# Altium project 100870_project.prjpcb
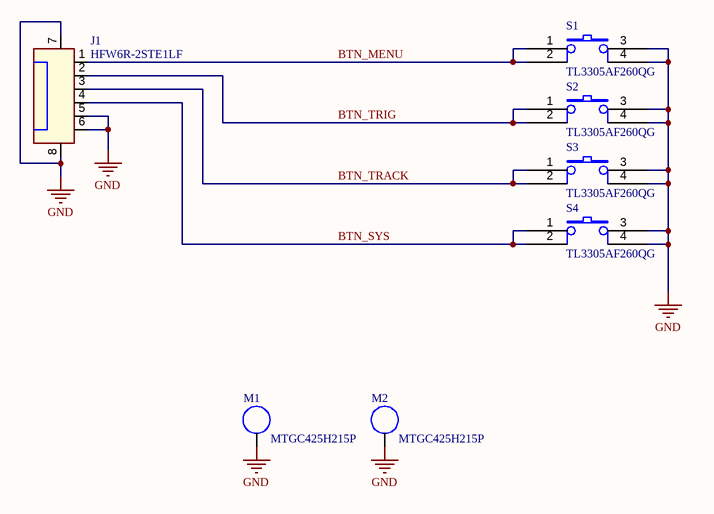
[diagram p0: Handle_Button.SchDoc]
Board_Name: Handle Button Board; Board_Number: 100870; PCB_Revision: 02; Project_Name: Ventriloquist; Sch_Revision: 02
2 sheets, 7 parts. Net scope: global (net labels, ports and power ports of the same name join across sheets).
Board file: 100870.PcbDoc
Sheets:
  Handle_Button.SchDoc
  Revision_Log.SchDoc

## Sheet Handle_Button.SchDoc: Handle Button Board
size 431 x 279 mm; DrawnBy: D. Bruey, M. Ciuffo; Organization: Synapse Product Development, LLC.; Address1: 1511 6th Ave., Suite 400; Address2: Seattle, Washington 98101; Address3: 206.381.0898; Address4: www.synapse.com; DocumentNumber: 1; SheetNumber: 1; SheetTotal: 2; PageSetup: Record=PageOptions|CenterHorizontal=True|CenterVertical=True|PrintScale=1.06|XCorrection=1.00|YCorrection=1.00|PrintKind=1|BorderSize=5000000|LeftOffset=0|BottomOffset=0|Orientation=2|PaperLength=4318|PaperWidth=2794|Scale=100|PaperSource=7|PrintQuality=200|MediaType=1|DitherType=10|PrintScaleMode=1|PaperKind=11x17|PaperIndex=3

### Parts
J1  HFW6R-2STE1LF  [CON_FCI_HFW6R]
M1  MTGC425H215P  [MTGC425H215P]  (no BOM)
M2  MTGC425H215P  [MTGC425H215P]  (no BOM)
S1  TL3305AF260QG  [SW_TL3305_G]
S2  TL3305AF260QG  [SW_TL3305_G]
S3  TL3305AF260QG  [SW_TL3305_G]
S4  TL3305AF260QG  [SW_TL3305_G]

### Nets
GND: J1.5 J1.6 J1.7 J1.8 M1.1 M2.1 S1.3 S1.4 S2.3 S2.4 S3.3 S3.4 S4.3 S4.4
BTN_MENU: J1.1 S1.1 S1.2
BTN_SYS: J1.4 S4.1 S4.2
BTN_TRACK: J1.3 S3.1 S3.2
BTN_TRIG: J1.2 S2.1 S2.2

### Notes on the sheet
- Design Notes:
- Layout Notes:
- Project:
- Sheet Title:
- PCBA:
- PROPRIETARY AND CONFIDENTIAL
- Drawn by:
- Schematic Part Number:
- Schematic Revision:
- Date:
- Sheet:
- /

### Library data of the parts
J1 = HFW6R-2STE1LF: CONN FFC FPC TOP 6POS 1.00MM R/A; part_type: ffc/fpc; id: 1658; mfg: Amphenol FCI; dist: DIGIKEY; dist_pn: 609-1787-1-ND; positions: 6; TableName: viewAltiumConnectors; mfg_pn: HFW6R-2STE1LF; height: 1.9mm; status: Unknown
M1 M2 = MTGC425H215P: MTG, 4.25mm PAD, 2.15mm Plated Hole; part_type: mounting; id: 1240; dist_pn: None; TableName: viewAltiumMisc; mfg_pn: MTGC425H215P; height: 0.05MM; status: Unknown
S1-S4 = TL3305AF260QG: SWITCH TACTILE SPST-NO 50MA 12V; Part Number: TL3301AF260QG; Manufacturer: E-Switch; Dist PN: EG2527CT-ND; id: 1235; dist: Digikey; dist_pn: EG5353CT-ND; TableName: viewAltiumMisc; Distributor: Digikey; mfg_pn: TL3305AF260QG; mfg: E-Switch; part_type: switch; status: Unknown

## Sheet Revision_Log.SchDoc: Revision Log
size 431 x 279 mm; DrawnBy: D. Bruey, M. Ciuffo; Organization: Synapse Product Development, LLC.; Address1: 1511 6th Ave., Suite 400; Address2: Seattle, Washington 98101; Address3: 206.381.0898; Address4: www.synapse.com; DocumentNumber: 2; SheetNumber: 2; SheetTotal: 2; PageSetup: Record=PageOptions|CenterHorizontal=True|CenterVertical=True|PrintScale=1.06|XCorrection=1.00|YCorrection=1.00|PrintKind=1|BorderSize=5000000|LeftOffset=0|BottomOffset=0|Orientation=2|PaperLength=4318|PaperWidth=2794|Scale=100|PaperSource=7|PrintQuality=200|MediaType=1|DitherType=10|PrintScaleMode=1|PaperKind=11x17|PaperIndex=3
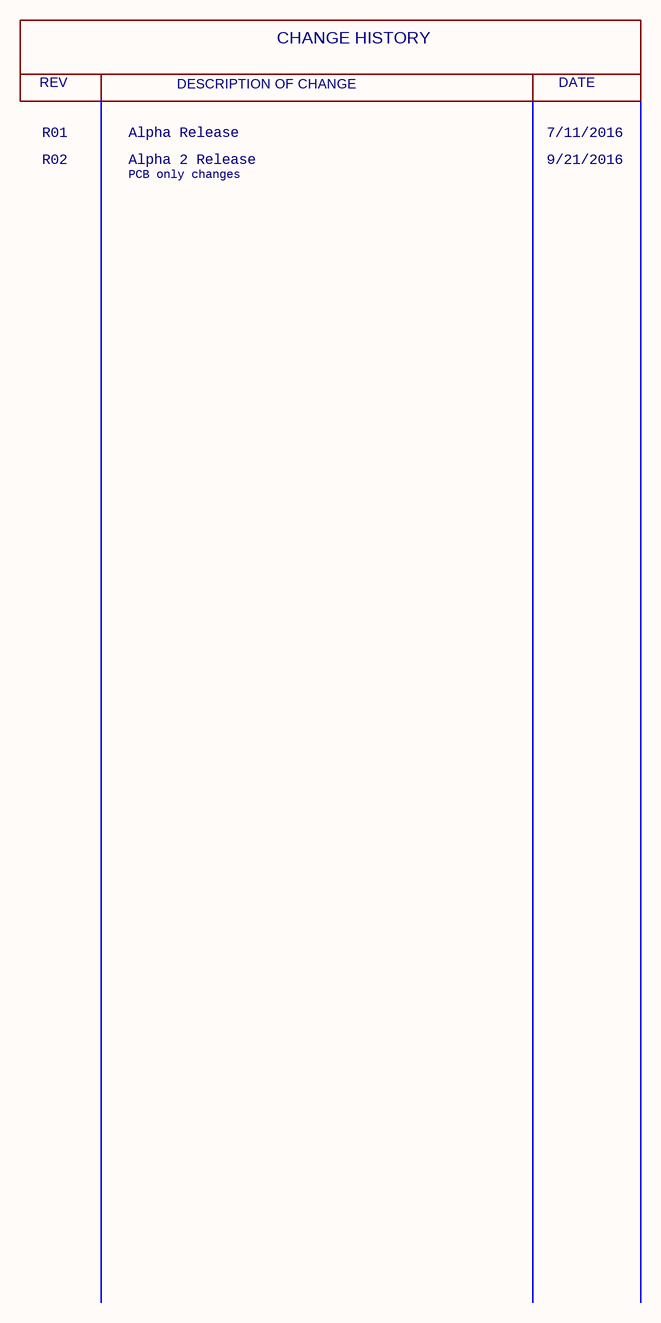
[diagram p1: Revision_Log.SchDoc]

### Notes on the sheet
- REV
- DESCRIPTION OF CHANGE
- CHANGE HISTORY
- DATE
- R01
- R02
- Alpha Release
- Alpha 2 Release
- 7/11/2016
- 9/21/2016
- PCB only changes
- Design Notes:
- Layout Notes:
- Project:
- Sheet Title:
- PCBA:
- PROPRIETARY AND CONFIDENTIAL
- Drawn by:
- Schematic Part Number:
- Schematic Revision:
- Date:
- Sheet:
- /

## Assembly variants
100870: all parts fitted